# Altium schematic sheet RV1103G11_RV1103G1.schdoc
size 248 x 127 mm
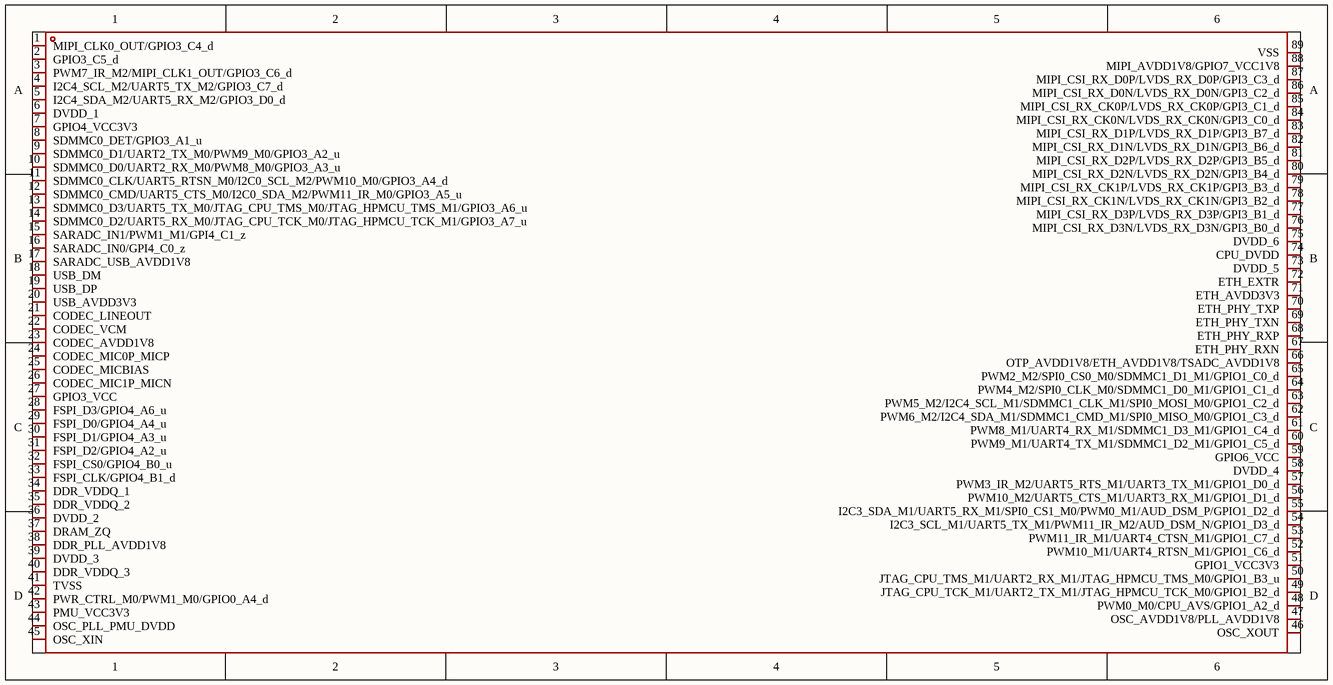
[diagram p0: RV1103G11_RV1103G1.schdoc]

## Parts
U?  RV1103G1  [QFN-88_L9.0-W9.0-P0.35-TL-EP6.5]  (value not drawn)

## Nets

Not connected (* = marked no-connect by the designer): U? 1(MIPI_CLK0_OUT/GPIO3_C4_d) 2(GPIO3_C5_d) 3(PWM7_IR_M2/MIPI_CLK1_OUT/GPIO3_C6_d) 4(I2C4_SCL_M2/UART5_TX_M2/GPIO3_C7_d) 5(I2C4_SDA_M2/UART5_RX_M2/GPIO3_D0_d) 6(DVDD_1) 7(GPIO4_VCC3V3) 8(SDMMC0_DET/GPIO3_A1_u) 9(SDMMC0_D1/UART2_TX_M0/PWM9_M0/GPIO3_A2_u) 10(SDMMC0_D0/UART2_RX_M0/PWM8_M0/GPIO3_A3_u) 11(SDMMC0_CLK/UART5_RTSN_M0/I2C0_SCL_M2/PWM10_M0/GPIO3_A4_d) 12(SDMMC0_CMD/UART5_CTS_M0/I2C0_SDA_M2/PWM11_IR_M0/GPIO3_A5_u) 13(SDMMC0_D3/UART5_TX_M0/JTAG_CPU_TMS_M0/JTAG_HPMCU_TMS_M1/GPIO3_A6_u) 14(SDMMC0_D2/UART5_RX_M0/JTAG_CPU_TCK_M0/JTAG_HPMCU_TCK_M1/GPIO3_A7_u) 15(SARADC_IN1/PWM1_M1/GPI4_C1_z) 16(SARADC_IN0/GPI4_C0_z) 17(SARADC_USB_AVDD1V8) 18(USB_DM) 19(USB_DP) 20(USB_AVDD3V3) 21(CODEC_LINEOUT) 22(CODEC_VCM) 23(CODEC_AVDD1V8) 24(CODEC_MIC0P_MICP) 25(CODEC_MICBIAS) 26(CODEC_MIC1P_MICN) 27(GPIO3_VCC) 28(FSPI_D3/GPIO4_A6_u) 29(FSPI_D0/GPIO4_A4_u) 30(FSPI_D1/GPIO4_A3_u) 31(FSPI_D2/GPIO4_A2_u) 32(FSPI_CS0/GPIO4_B0_u) 33(FSPI_CLK/GPIO4_B1_d) 34(DDR_VDDQ_1) 35(DDR_VDDQ_2) 36(DVDD_2) 37(DRAM_ZQ) 38(DDR_PLL_AVDD1V8) 39(DVDD_3) 40(DDR_VDDQ_3) 41(TVSS) 42(PWR_CTRL_M0/PWM1_M0/GPIO0_A4_d) 43(PMU_VCC3V3) 44(OSC_PLL_PMU_DVDD) 45(OSC_XIN) 46(OSC_XOUT) 47(OSC_AVDD1V8/PLL_AVDD1V8) 48(PWM0_M0/CPU_AVS/GPIO1_A2_d) 49(JTAG_CPU_TCK_M1/UART2_TX_M1/JTAG_HPMCU_TCK_M0/GPIO1_B2_d) 50(JTAG_CPU_TMS_M1/UART2_RX_M1/JTAG_HPMCU_TMS_M0/GPIO1_B3_u) 51(GPIO1_VCC3V3) 52(PWM10_M1/UART4_RTSN_M1/GPIO1_C6_d) 53(PWM11_IR_M1/UART4_CTSN_M1/GPIO1_C7_d) 54(I2C3_SCL_M1/UART5_TX_M1/PWM11_IR_M2/AUD_DSM_N/GPIO1_D3_d) 55(I2C3_SDA_M1/UART5_RX_M1/SPI0_CS1_M0/PWM0_M1/AUD_DSM_P/GPIO1_D2_d) 56(PWM10_M2/UART5_CTS_M1/UART3_RX_M1/GPIO1_D1_d) 57(PWM3_IR_M2/UART5_RTS_M1/UART3_TX_M1/GPIO1_D0_d) 58(DVDD_4) 59(GPIO6_VCC) 60(PWM9_M1/UART4_TX_M1/SDMMC1_D2_M1/GPIO1_C5_d) 61(PWM8_M1/UART4_RX_M1/SDMMC1_D3_M1/GPIO1_C4_d) 62(PWM6_M2/I2C4_SDA_M1/SDMMC1_CMD_M1/SPI0_MISO_M0/GPIO1_C3_d) 63(PWM5_M2/I2C4_SCL_M1/SDMMC1_CLK_M1/SPI0_MOSI_M0/GPIO1_C2_d) 64(PWM4_M2/SPI0_CLK_M0/SDMMC1_D0_M1/GPIO1_C1_d) 65(PWM2_M2/SPI0_CS0_M0/SDMMC1_D1_M1/GPIO1_C0_d) 66(OTP_AVDD1V8/ETH_AVDD1V8/TSADC_AVDD1V8) 67(ETH_PHY_RXN) 68(ETH_PHY_RXP) 69(ETH_PHY_TXN) 70(ETH_PHY_TXP) 71(ETH_AVDD3V3) 72(ETH_EXTR) 73(DVDD_5) 74(CPU_DVDD) 75(DVDD_6) 76(MIPI_CSI_RX_D3N/LVDS_RX_D3N/GPI3_B0_d) 77(MIPI_CSI_RX_D3P/LVDS_RX_D3P/GPI3_B1_d) 78(MIPI_CSI_RX_CK1N/LVDS_RX_CK1N/GPI3_B2_d) 79(MIPI_CSI_RX_CK1P/LVDS_RX_CK1P/GPI3_B3_d) 80(MIPI_CSI_RX_D2N/LVDS_RX_D2N/GPI3_B4_d) 81(MIPI_CSI_RX_D2P/LVDS_RX_D2P/GPI3_B5_d) 82(MIPI_CSI_RX_D1N/LVDS_RX_D1N/GPI3_B6_d) 83(MIPI_CSI_RX_D1P/LVDS_RX_D1P/GPI3_B7_d) 84(MIPI_CSI_RX_CK0N/LVDS_RX_CK0N/GPI3_C0_d) 85(MIPI_CSI_RX_CK0P/LVDS_RX_CK0P/GPI3_C1_d) 86(MIPI_CSI_RX_D0N/LVDS_RX_D0N/GPI3_C2_d) 87(MIPI_CSI_RX_D0P/LVDS_RX_D0P/GPI3_C3_d) 88(MIPI_AVDD1V8/GPIO7_VCC1V8) 89(VSS)

## Library data of the parts
U? = RV1103G1: Manufacturer: Rockchip(瑞芯微); Add into BOM: yes; Symbol: RV1103G1; Device: RV1103G1; LCSC Part Name: RV1103G1; Supplier Part: C5307358; Manufacturer Part: RV1103G1; Supplier Footprint: QFN-88(9x9); JLCPCB Part Class: Extended Part; Datasheet: https://item.szlcsc.com/datasheet/RV1103G1/6060206.html; Supplier: LCSC; Convert to PCB: yes